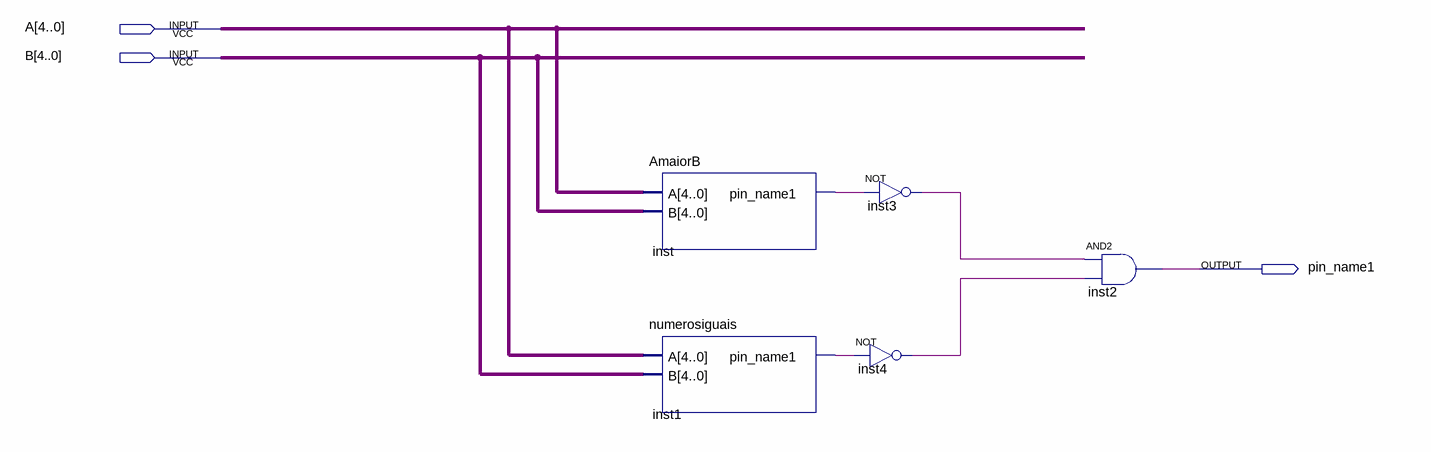
[diagram p0: schematic sheet]
// Quartus schematic numeromenor.bdf as structural Verilog: 5 symbols, 3 pins
module numeromenor (
  input  [4:0] A,
  input  [4:0] B,
  output pin_name1
);

  wire inst1_pin_name1, inst3_out, inst4_out, inst_pin_name1;

  AmaiorB inst (.A(A), .B(B), .pin_name1(inst_pin_name1));
  numerosiguais inst1 (.A(A), .B(B), .pin_name1(inst1_pin_name1));
  not inst3 (inst3_out, inst_pin_name1);
  not inst4 (inst4_out, inst1_pin_name1);
  and inst2 (pin_name1, inst3_out, inst4_out);
endmodule
